# Altium schematic sheet SampleHoldCircuit.SchDoc
size A4; SheetNumber: 3; SheetTotal: 3
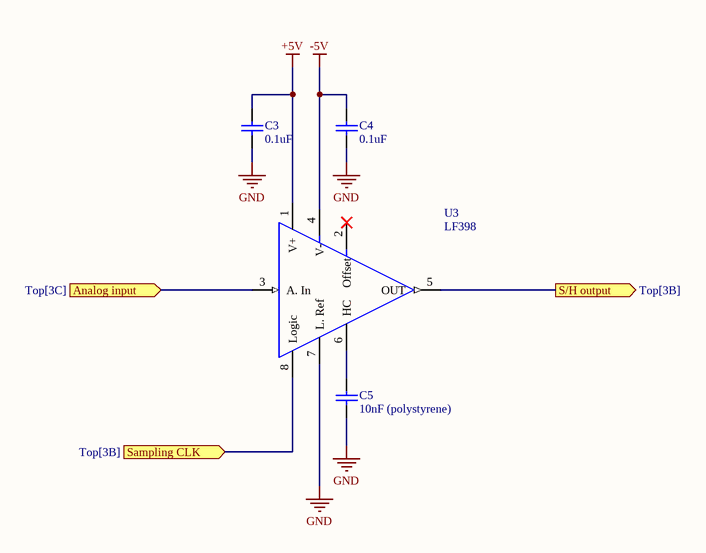
[diagram p0: SampleHoldCircuit.SchDoc]

## Parts
C3  0.1uF
C4  0.1uF
C5  10nF (polystyrene)
U3  LF398

## Ports
Analog input (in, see Top[3C]), S/H output (out, see Top[3B]), Sampling CLK (in, see Top[3B])

## Nets
+5V: C3.2 U3.1(V+)
-5V: C4.2 U3.4(V-)
GND: C3.1 C4.1 C5.1 U3.7(L._Ref)
Analog input: U3.3(A._In) ; port Analog input
S/H output: U3.5(OUT) ; port S/H output
Sampling CLK: U3.8(Logic) ; port Sampling CLK
NetC5_2: C5.2 U3.6(HC)

Not connected (* = marked no-connect by the designer): U3 2(Offset)*

## Library data of the parts
C3-C5 = Cap: Ceramic Capacitor; Value: 100pF; Published: 8-Jun-2000; LatestRevisionDate: 17-Jul-2002; LatestRevisionNote: Re-released for DXP Platform.; PackageReference: RAD-0.3; Publisher: Altium Limited; PackageDescription: Radial Cap, Thru-Hole; 2 Leads; 0.3 in Pin Spacing
U3 = LF398: Sample and Hold